# Altium project TivaC.PrjPcb
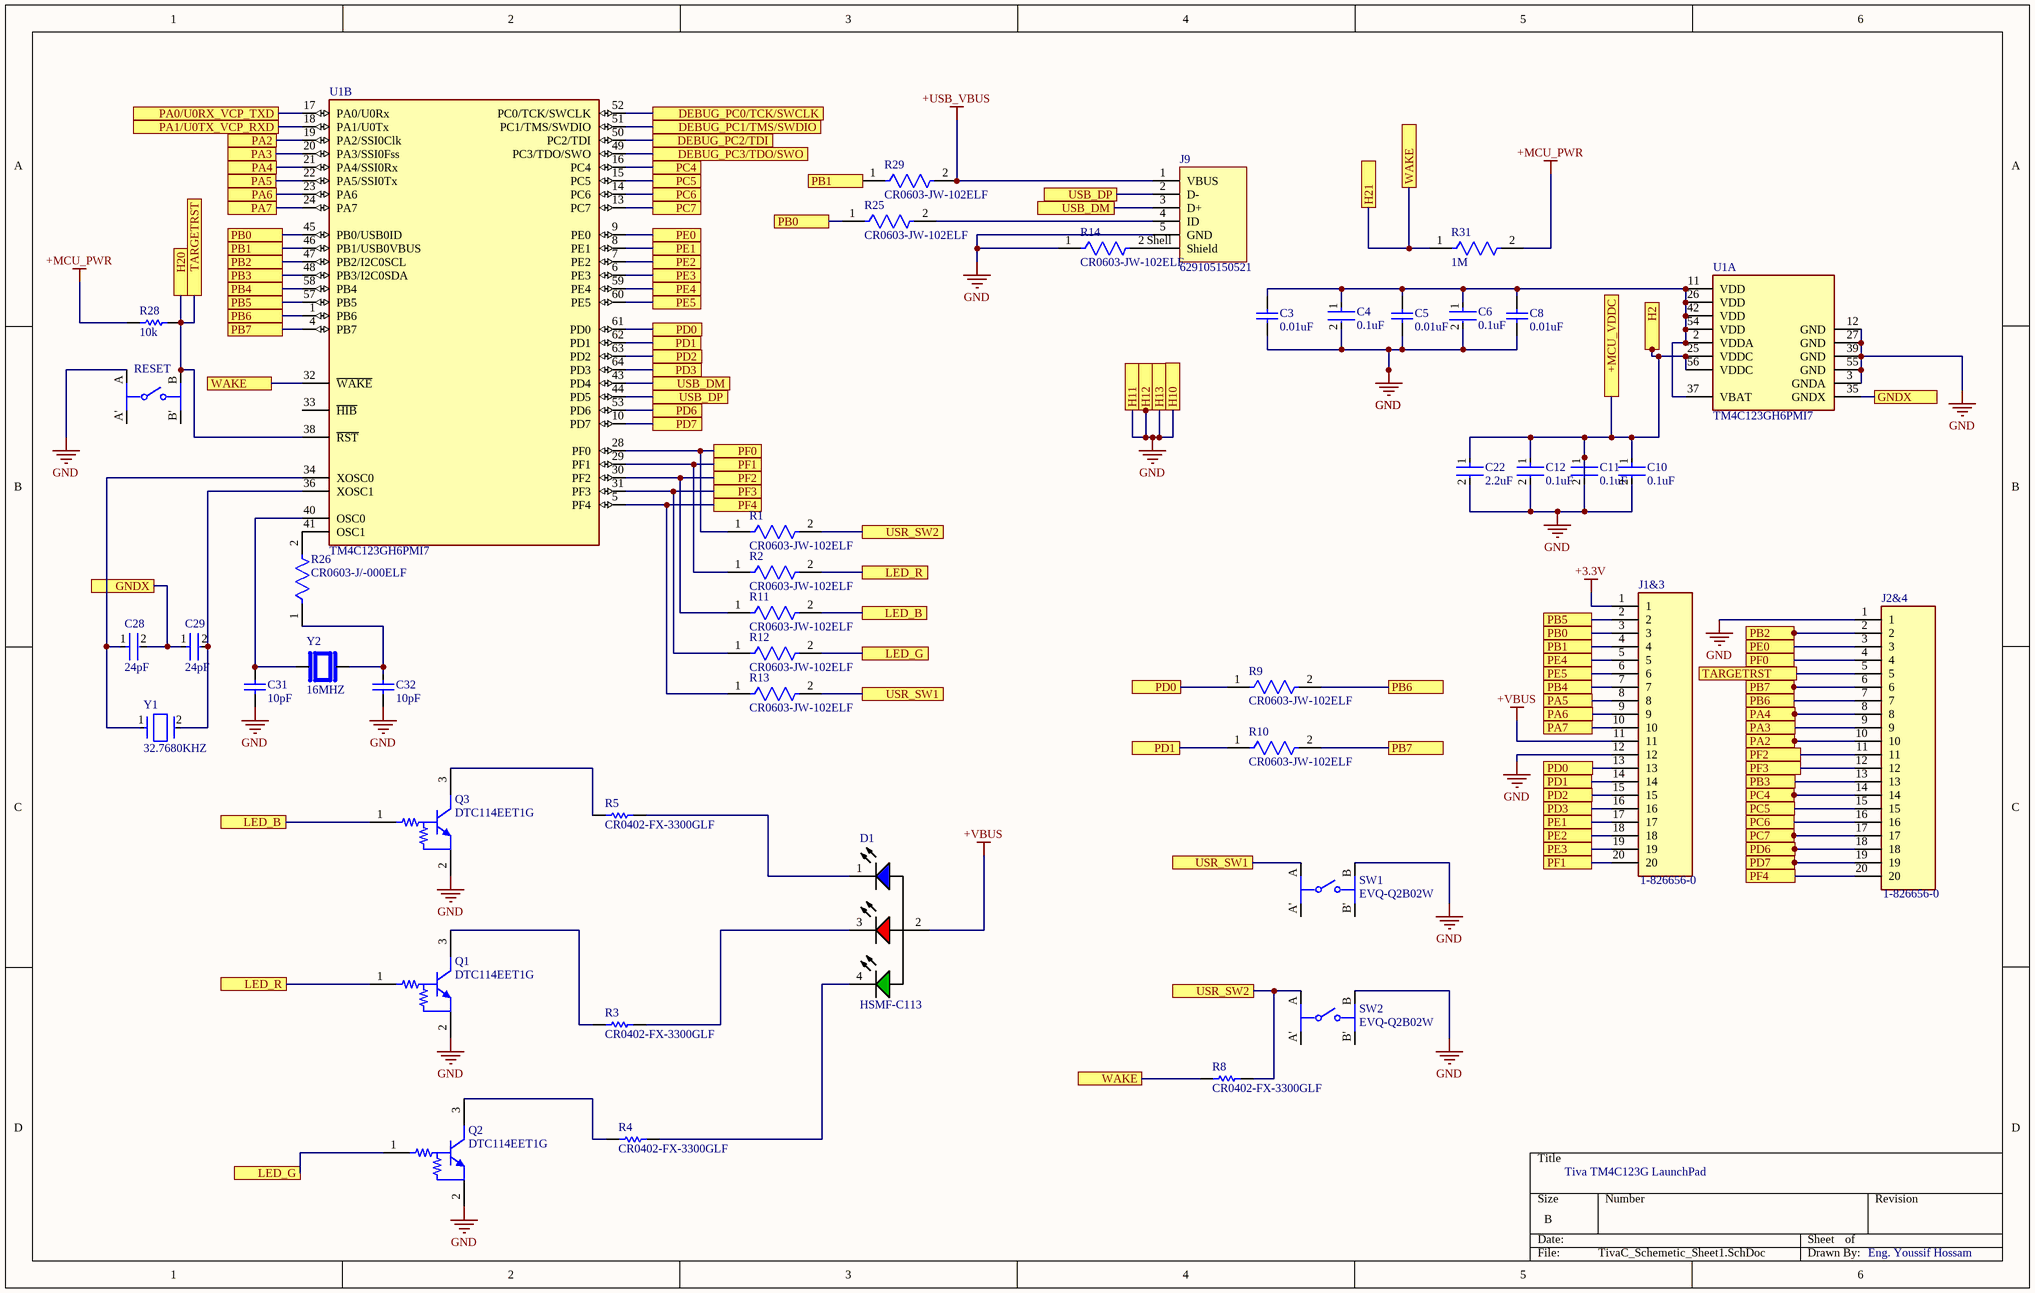
[diagram p0: TivaC_Schemetic_Sheet1.SchDoc]
Date: 8/5/2024; Designer: Eng. Youssif Hossam; Title: Tiva TM4C123G LaunchPad
2 sheets, 73 parts. Net scope: flat (ports and power ports of the same name join across sheets).
Board file: PCB1.PcbDoc
Sheets:
  TivaC_Schemetic_Sheet1.SchDoc
  TivaC_Schemetic_Sheet2.SchDoc

## Sheet TivaC_Schemetic_Sheet1.SchDoc: Tiva TM4C123G LaunchPad
size B; SheetNumber: 1; SheetTotal: 2

### Parts
C3  0.01uF  [CAPC1005X55X30LL05T10]
C4  0.1uF  [FP-C0402-BB-MFG]
C5  0.01uF  [CAPC1005X55X30LL05T10]
C6  0.1uF  [FP-C0402-BB-MFG]
C8  0.01uF  [CAPC1005X55X30LL05T10]
C10  0.1uF  [FP-C0402-BB-MFG]
C11  0.1uF  [FP-C0402-BB-MFG]
C12  0.1uF  [FP-C0402-BB-MFG]
C22  2.2uF  [FP-C0603C225K4PACTU-MFG]
C28  24pF  [FP-C0402-BB-MFG]
C29  24pF  [FP-C0402-BB-MFG]
C31  10pF  [CAPC1005X55X25ML05T05]
C32  10pF  [CAPC1005X55X25ML05T05]
D1  HSMF-C113  [AVAG-HSMF-C11X_H1_V]
J1&3  1-826656-0  [TE_1-826656-0]
J2&4  1-826656-0  [TE_1-826656-0]
J9  629105150521  [629105150521]
Q1  DTC114EET1G  [ONSC-SC-75-3-463-01_V]
Q2  DTC114EET1G  [ONSC-SC-75-3-463-01_V]
Q3  DTC114EET1G  [ONSC-SC-75-3-463-01_V]
R1  CR0603-JW-102ELF  [FP-CR0603-IPC_A]
R2  CR0603-JW-102ELF  [FP-CR0603-IPC_A]
R3  CR0402-FX-3300GLF  [RESC1005X40X25NL10T10]
R4  CR0402-FX-3300GLF  [RESC1005X40X25NL10T10]
R5  CR0402-FX-3300GLF  [RESC1005X40X25NL10T10]
R8  CR0402-FX-3300GLF  [RESC1005X40X25NL10T10]
R9  CR0603-JW-102ELF  [FP-CR0603-IPC_A]
R10  CR0603-JW-102ELF  [FP-CR0603-IPC_A]
R11  CR0603-JW-102ELF  [FP-CR0603-IPC_A]
R12  CR0603-JW-102ELF  [FP-CR0603-IPC_A]
R13  CR0603-JW-102ELF  [FP-CR0603-IPC_A]
R14  CR0603-JW-102ELF  [FP-CR0603-IPC_A]
R25  CR0603-JW-102ELF  [FP-CR0603-IPC_A]
R26  CR0603-J/-000ELF  [FP-CR0603-MFG]
R28  10k  [RESC1005X40X25NL10T10]
R29  CR0603-JW-102ELF  [FP-CR0603-IPC_A]
R31  1M  [FP-CR0402-MFG]
RESET  EVQ-Q2B02W  [FP-EVQ-Q2B02W-MFG]  (value not drawn)
SW1  EVQ-Q2B02W  [FP-EVQ-Q2B02W-MFG]
SW2  EVQ-Q2B02W  [FP-EVQ-Q2B02W-MFG]
U1  TM4C123GH6PMI7  [FP-PM0064A-MFG]  (parts A,B of 2)
Y1  32.7680KHZ  [FP-AB26TRB-MFG]
Y2  16MHZ  [XTAL_NX5032GA-16.000000MHZ-LN-CD-1]

### Ports
+MCU_VDDC, DEBUG_PC0/TCK/SWCLK (see TivaC_Schemetic_Sheet2[4A], TivaC_Schemetic_Sheet2[4C]), DEBUG_PC1/TMS/SWDIO (see TivaC_Schemetic_Sheet2[4A], TivaC_Schemetic_Sheet2[4C]), DEBUG_PC2/TDI (see TivaC_Schemetic_Sheet2[4A]), DEBUG_PC3/TDO/SWO (see TivaC_Schemetic_Sheet2[4A], TivaC_Schemetic_Sheet2[4B]), GNDX (see TivaC_Schemetic_Sheet1[1B]), GNDX (see TivaC_Schemetic_Sheet1[6B]), H2, H10, H11, H12, H13 (see TivaC_Schemetic_Sheet2[4B]), H20, H21, LED_B (see TivaC_Schemetic_Sheet1[1C]), LED_B (see TivaC_Schemetic_Sheet1[3B]), LED_G (see TivaC_Schemetic_Sheet1[1D]), LED_G (see TivaC_Schemetic_Sheet1[3C]), LED_R (see TivaC_Schemetic_Sheet1[1D]), LED_R (see TivaC_Schemetic_Sheet1[3B]), PA0/U0RX_VCP_TXD (see TivaC_Schemetic_Sheet2[4A]), PA1/U0TX_VCP_RXD (see TivaC_Schemetic_Sheet2[4A]), PA2 (see TivaC_Schemetic_Sheet1[1A]), PA2 (see TivaC_Schemetic_Sheet1[6C]), PA3 (see TivaC_Schemetic_Sheet1[1A]), PA3 (see TivaC_Schemetic_Sheet1[6C]), PA4 (see TivaC_Schemetic_Sheet1[1A]), PA4 (see TivaC_Schemetic_Sheet1[6C]), PA5 (see TivaC_Schemetic_Sheet1[1A]), PA5 (see TivaC_Schemetic_Sheet1[5C]), PA6 (see TivaC_Schemetic_Sheet1[1A]), PA6 (see TivaC_Schemetic_Sheet1[5C]), PA7 (see TivaC_Schemetic_Sheet1[1A]), PA7 (see TivaC_Schemetic_Sheet1[5C]), PB0 (see TivaC_Schemetic_Sheet1[1A], TivaC_Schemetic_Sheet1[3A]), PB0 (see TivaC_Schemetic_Sheet1[1A], TivaC_Schemetic_Sheet1[5B]), PB0 (see TivaC_Schemetic_Sheet1[3A], TivaC_Schemetic_Sheet1[5B]), PB1 (see TivaC_Schemetic_Sheet1[1A], TivaC_Schemetic_Sheet1[3A]), PB1 (see TivaC_Schemetic_Sheet1[1A], TivaC_Schemetic_Sheet1[5C]), PB1 (see TivaC_Schemetic_Sheet1[3A], TivaC_Schemetic_Sheet1[5C]), PB2 (see TivaC_Schemetic_Sheet1[1A]), PB2 (see TivaC_Schemetic_Sheet1[6B]), PB3 (see TivaC_Schemetic_Sheet1[1A]), PB3 (see TivaC_Schemetic_Sheet1[6C]), PB4 (see TivaC_Schemetic_Sheet1[1A]), PB4 (see TivaC_Schemetic_Sheet1[5C]), PB5 (see TivaC_Schemetic_Sheet1[1A]), PB5 (see TivaC_Schemetic_Sheet1[5B]), PB6 (see TivaC_Schemetic_Sheet1[1A], TivaC_Schemetic_Sheet1[5C]), PB6 (see TivaC_Schemetic_Sheet1[1A], TivaC_Schemetic_Sheet1[6C]), PB6 (see TivaC_Schemetic_Sheet1[5C], TivaC_Schemetic_Sheet1[6C]), PB7 (see TivaC_Schemetic_Sheet1[1B], TivaC_Schemetic_Sheet1[5C]), PB7 (see TivaC_Schemetic_Sheet1[1B], TivaC_Schemetic_Sheet1[6C]), PB7 (see TivaC_Schemetic_Sheet1[5C], TivaC_Schemetic_Sheet1[6C]), PC4 (see TivaC_Schemetic_Sheet1[2A]), PC4 (see TivaC_Schemetic_Sheet1[6C]), PC5 (see TivaC_Schemetic_Sheet1[2A]), PC5 (see TivaC_Schemetic_Sheet1[6C]), PC6 (see TivaC_Schemetic_Sheet1[2A]), PC6 (see TivaC_Schemetic_Sheet1[6C]), PC7 (see TivaC_Schemetic_Sheet1[2A]), PC7 (see TivaC_Schemetic_Sheet1[6C]), PD0 (see TivaC_Schemetic_Sheet1[2B], TivaC_Schemetic_Sheet1[4C]), PD0 (see TivaC_Schemetic_Sheet1[2B], TivaC_Schemetic_Sheet1[5C]), PD0 (see TivaC_Schemetic_Sheet1[4C], TivaC_Schemetic_Sheet1[5C]), PD1 (see TivaC_Schemetic_Sheet1[2B], TivaC_Schemetic_Sheet1[4C]), PD1 (see TivaC_Schemetic_Sheet1[2B], TivaC_Schemetic_Sheet1[5C]), PD1 (see TivaC_Schemetic_Sheet1[4C], TivaC_Schemetic_Sheet1[5C]), PD2 (see TivaC_Schemetic_Sheet1[2B]), PD2 (see TivaC_Schemetic_Sheet1[5C]), PD3 (see TivaC_Schemetic_Sheet1[2B]), PD3 (see TivaC_Schemetic_Sheet1[5C]), PD6 (see TivaC_Schemetic_Sheet1[2B]), PD6 (see TivaC_Schemetic_Sheet1[6C]), PD7 (see TivaC_Schemetic_Sheet1[2B]), PD7 (see TivaC_Schemetic_Sheet1[6C]), PE0 (see TivaC_Schemetic_Sheet1[2A]), PE0 (see TivaC_Schemetic_Sheet1[6C]), PE1 (see TivaC_Schemetic_Sheet1[2A]), PE1 (see TivaC_Schemetic_Sheet1[5C]), PE2 (see TivaC_Schemetic_Sheet1[2A]), PE2 (see TivaC_Schemetic_Sheet1[5C]), PE3 (see TivaC_Schemetic_Sheet1[2A]), PE3 (see TivaC_Schemetic_Sheet1[5C]), PE4 (see TivaC_Schemetic_Sheet1[2A]), PE4 (see TivaC_Schemetic_Sheet1[5C]), PE5 (see TivaC_Schemetic_Sheet1[2A]), PE5 (see TivaC_Schemetic_Sheet1[5C]), PF0 (see TivaC_Schemetic_Sheet1[3B]), PF0 (see TivaC_Schemetic_Sheet1[6C]), PF1 (see TivaC_Schemetic_Sheet1[3B]), PF1 (see TivaC_Schemetic_Sheet1[5C]), PF2 (see TivaC_Schemetic_Sheet1[3B]), PF2 (see TivaC_Schemetic_Sheet1[6C]), PF3 (see TivaC_Schemetic_Sheet1[3B]), PF3 (see TivaC_Schemetic_Sheet1[6C]), PF4 (see TivaC_Schemetic_Sheet1[3B]), PF4 (see TivaC_Schemetic_Sheet1[6C]), TARGETRST (see TivaC_Schemetic_Sheet1[1A], TivaC_Schemetic_Sheet2[4A]), TARGETRST (see TivaC_Schemetic_Sheet1[6C], TivaC_Schemetic_Sheet2[4A]), USB_DM (see TivaC_Schemetic_Sheet1[2B]), USB_DM (see TivaC_Schemetic_Sheet1[4A]), USB_DP (see TivaC_Schemetic_Sheet1[2B]), USB_DP (see TivaC_Schemetic_Sheet1[4A]), USR_SW1 (see TivaC_Schemetic_Sheet1[3C]), USR_SW1 (see TivaC_Schemetic_Sheet1[4C]), USR_SW2 (see TivaC_Schemetic_Sheet1[3B]), USR_SW2 (see TivaC_Schemetic_Sheet1[4D]), WAKE (see TivaC_Schemetic_Sheet1[1B], TivaC_Schemetic_Sheet1[4D]), WAKE (see TivaC_Schemetic_Sheet1[1B], TivaC_Schemetic_Sheet1[5A]), WAKE (see TivaC_Schemetic_Sheet1[4D], TivaC_Schemetic_Sheet1[5A])

### Nets
+3.3V: J1&3.1
+MCU_PWR: R28.1 R31.2
+USB_VBUS: J9.1(VBUS) R29.2
+VBUS: D1.2(A) J1&3.11
GND: C3.1 C4.2 C5.1 C6.2 C8.1 C10.2 C11.2 C12.2 C22.2 C31.1 C32.1 J1&3.12 J2&4.1 J9.5(GND) Q1.2(E) Q2.2(E) Q3.2(E) R14.1 RESET.A SW1.B SW2.B U1.3(GNDA) U1.12(GND) U1.27(GND) U1.39(GND) U1.55(GND) ; port H11, port H12, port H13, port H10
NetC3_2: C3.2 C4.1 C5.2 C6.1 C8.2 U1.2(VDDA) U1.11(VDD) U1.26(VDD) U1.37(VBAT) U1.42(VDD) U1.54(VDD)
NetC10_1: C10.1 C11.1 C12.1 C22.1 U1.25(VDDC) U1.56(VDDC) ; port H2, port +MCU_VDDC
NetC28_1: C28.1 U1.34(XOSC0) Y1.1
NetC28_2: C28.2 C29.1 U1.35(GNDX) ; port GNDX
NetC29_2: C29.2 U1.36(XOSC1) Y1.2
NetC31_2: C31.2 U1.40(OSC0) Y2.1
NetC32_2: C32.2 R26.1 Y2.2
NetD1_1: D1.1(K) R5.2
NetD1_3: D1.3(K) R3.2
NetD1_4: D1.4(K) R4.2
NetJ1&3_2: J1&3.2 U1.57(PB5) ; port PB5
NetJ1&3_3: J1&3.3 R25.1 U1.45(PB0/USB0ID) ; port PB0
NetJ1&3_4: J1&3.4 R29.1 U1.46(PB1/USB0VBUS) ; port PB1
NetJ1&3_5: J1&3.5 U1.59(PE4) ; port PE4
NetJ1&3_6: J1&3.6 U1.60(PE5) ; port PE5
NetJ1&3_7: J1&3.7 U1.58(PB4) ; port PB4
NetJ1&3_8: J1&3.8 U1.22(PA5/SSI0Tx) ; port PA5
NetJ1&3_9: J1&3.9 U1.23(PA6) ; port PA6
NetJ1&3_10: J1&3.10 U1.24(PA7) ; port PA7
NetJ1&3_13: J1&3.13 R9.1 U1.61(PD0) ; port PD0
NetJ1&3_14: J1&3.14 R10.1 U1.62(PD1) ; port PD1
NetJ1&3_15: J1&3.15 U1.63(PD2) ; port PD2
NetJ1&3_16: J1&3.16 U1.64(PD3) ; port PD3
NetJ1&3_17: J1&3.17 U1.8(PE1) ; port PE1
NetJ1&3_18: J1&3.18 U1.7(PE2) ; port PE2
NetJ1&3_19: J1&3.19 U1.6(PE3) ; port PE3
NetJ1&3_20: J1&3.20 R2.1 U1.29(PF1) ; port PF1
NetJ2&4_2: J2&4.2 U1.47(PB2/I2C0SCL) ; port PB2
NetJ2&4_3: J2&4.3 U1.9(PE0) ; port PE0
NetJ2&4_4: J2&4.4 R1.1 U1.28(PF0) ; port PF0
NetJ2&4_5: J2&4.5 R28.2 RESET.B U1.38(~{RST}) ; port TARGETRST, port H20
NetJ2&4_6: J2&4.6 R10.2 U1.4(PB7) ; port PB7
NetJ2&4_7: J2&4.7 R9.2 U1.1(PB6) ; port PB6
NetJ2&4_8: J2&4.8 U1.21(PA4/SSI0Rx) ; port PA4
NetJ2&4_9: J2&4.9 U1.20(PA3/SSI0Fss) ; port PA3
NetJ2&4_10: J2&4.10 U1.19(PA2/SSI0Clk) ; port PA2
NetJ2&4_11: J2&4.11 R11.1 U1.30(PF2) ; port PF2
NetJ2&4_12: J2&4.12 R12.1 U1.31(PF3) ; port PF3
NetJ2&4_13: J2&4.13 U1.48(PB3/I2C0SDA) ; port PB3
NetJ2&4_14: J2&4.14 U1.16(PC4) ; port PC4
NetJ2&4_15: J2&4.15 U1.15(PC5) ; port PC5
NetJ2&4_16: J2&4.16 U1.14(PC6) ; port PC6
NetJ2&4_17: J2&4.17 U1.13(PC7) ; port PC7
NetJ2&4_18: J2&4.18 U1.53(PD6) ; port PD6
NetJ2&4_19: J2&4.19 U1.10(PD7) ; port PD7
NetJ2&4_20: J2&4.20 R13.1 U1.5(PF4) ; port PF4
NetJ9_2: J9.2(D-) U1.44(PD5) ; port USB_DP
NetJ9_3: J9.3(D+) U1.43(PD4) ; port USB_DM
NetJ9_4: J9.4(ID) R25.2
NetJ9_Shell: J9.Shell(Shield) R14.2
NetQ1_1: Q1.1(B) R2.2 ; port LED_R
NetQ1_3: Q1.3(C) R3.1
NetQ2_1: Q2.1(B) R12.2 ; port LED_G
NetQ2_3: Q2.3(C) R4.1
NetQ3_1: Q3.1(B) R11.2 ; port LED_B
NetQ3_3: Q3.3(C) R5.1
NetR1_2: R1.2 R8.2 SW2.A ; port USR_SW2
NetR8_1: R8.1 R31.1 U1.32(~{WAKE}) ; port WAKE, port H21
NetR13_2: R13.2 SW1.A ; port USR_SW1
NetR18_2: U1.51(PC1/TMS/SWDIO) ; port DEBUG_PC1/TMS/SWDIO
NetR23_2: U1.52(PC0/TCK/SWCLK) ; port DEBUG_PC0/TCK/SWCLK
NetR26_2: R26.2 U1.41(OSC1)
NetU1_17: U1.17(PA0/U0Rx) ; port PA0/U0RX_VCP_TXD
NetU1_18: U1.18(PA1/U0Tx) ; port PA1/U0TX_VCP_RXD
NetU1_49: U1.49(PC3/TDO/SWO) ; port DEBUG_PC3/TDO/SWO
NetU1_50: U1.50(PC2/TDI) ; port DEBUG_PC2/TDI

Not connected (* = marked no-connect by the designer): RESET A' B'; SW1 A' B'; SW2 A' B'; U1 33(~{HIB})

### Notes on the sheet
- Labels drawn without touching a wire or pin: GND

### Library data of the parts
C3 C5 C8 = CMP-1034-01886-2: Part Number: C0402C103K5RACTU; Manufacturer: Kemet
C4 C6 C10-C12 = CMP-1034-02068-3: CAP CER 0.1UF 16V 5% X7R 0402; Manufacturer: Kemet; Manufacturer Part Number: C0402C104J4RACTU; Value: 0.10 μF; Temperature Coefficient: 15%; Tolerance: 0.05; Material: Ceramic; ComponentLink2URL: https://content.kemet.com/datasheets/KEM_C1002_X7R_SMD.pdf; Automotive: No; Device Class L2: Capacitors; Temperature: -55°C to +125°C; RoHS: TRUE; Voltage Rating: 16 V; ComponentLink2Description: Datasheet; Device Class L3: Ceramic Capacitors; Temperature Range Low: -55°C; Ipc Land Pattern Name: CAPC10050X50; Device Class L1: Passive Components; Temperature Range High: +125°C; Package: C0402-BB; Capacitance: 0.10 μF; Category: Cap; Mouser Description: CAP CER 0.1UF 16V X7R 0402; Height: 0.55mm; Digikey Description: CAP CER 0.1UF 16V 5% X7R 0402; Octopart: https://octopart.com/c0402c104j4ractu-kemet-12573893; Temperature Characteristic: X7R; Lead Free: Yes
C22 = CMP-2006-02259-2: CAP CER 2.2UF 16V X5R 0603; Dielectric Material: Ceramic; Tolerance: 10%; Dissipation Factor: 5%; Series: C; Voltage Rating (DC): 16V; REACH SVHC: No SVHC; RoHS Compliant: Yes; Number of Pins: 2; Max Operating Temperature: 85°C; Voltage Rating: 16V; Min Operating Temperature: -55°C; Termination: SMD/SMT; Dielectric: X5R; Packaging: Tape and Reel; Contact Plating: Tin; Case Code (Metric): 1608; Height: 0.8mm; Capacitance: 2.2uF; Case/Package: 0603; Width: 0.8mm; Construction: Flat; Depth: 0.8mm; Thickness: 0.034inch; Radiation Hardening: No; Length: 1.6mm; Mount: Surface Mount; Case Code (Imperial): 0603; Voltage: 16V; Package Quantity: 1; Lead Free: Lead Free
C28 C29 = CMP-1034-00941-3: Manufacturer Part Number: C0402C240J5GACTU; Manufacturer: Kemet; Temperature Coefficient: 15%; Voltage Rating: 50 V; Tolerance: 0.05; Material: Ceramic; Temperature Characteristic: C0G; Value: 24 pF; Lead Free: Yes; Automotive: No; Category: Cap; Device Class L1: Passive Components; Ipc Land Pattern Name: CAPC10050X50; Package: C0402-BB; Mouser Description: Multilayer Ceramic Capacitors MLCC - SMD/SMT 50volts 24pF C0G 5%; Temperature: -55°C to +125°C; Temperature Range Low: -55°C; RoHS: TRUE; Height: 0.55mm; ComponentLink2URL: https://content.kemet.com/datasheets/KEM_C1002_X7R_SMD.pdf; Device Class L2: Capacitors; Digikey Description: CAP CER 24PF 50V 5% NP0 0402; Capacitance: 24 pF; ComponentLink2Description: Datasheet; Octopart: https://octopart.com/c0402c240j5gactu-kemet-9138560; Device Class L3: Ceramic Capacitors; Temperature Range High: +125°C
C31 C32 = CMP-2100-03589-1: Chip Capacitor, 10 pF, +/- 5%, 50 V, -55 to 125 degC, 0402 (1005 Metric), RoHS, Tape and Reel; Manufacturer: Yageo; Insulation Resistance: 100GR; Voltage Rating (DC): 50V; Dielectric Material: Ceramic; Temperature Coefficient: 30ppm/degC; Dielectric: C0G; Termination: SMD/SMT; Package Reference: 0402; Lead Free: LeadFree; Composition: Ceramic; Tolerance: 5%; Case Code (Metric): 1005; Voltage Rating: 50V; Packaging: TapeandReel; Manufacturer URL: http://www.yageo.com/; REACH SVHC: NoSVHC; Max Operating Temperature: 125degC; Length: 1mm; Mount: SurfaceMount; Depth: 0.5mm; Min Operating Temperature: -55degC; Number of Pins: 2; Width: 0.02inch; Datasheet Version: Rev. 14, 07/2016; Package Quantity: 1; Datasheet URL: http://www.yageo.com/documents/recent/UPY-GP_NP0_16V-to-50V_14.pdf; Case Code (Imperial): 0402; RoHSCompliant: True; Radiation Hardening: No; Height: 0.5mm; Case/Package: 0402; Thickness: 0.022inch; Capacitance: 10pF; Package Description: 2-Pin Surface Mount Device, Body 1 x 0.5 mm; Voltage: 50V
D1 = CMP-2000-06422-1: Right Angle Tricolor Surface Mount Chip LED, Red/Green/Blue, -40 to 85 degC, 4-Pin SMD, RoHS, Tape and Reel; Manufacturer: Avago; Product Length (mm): 2.5mm; Product Depth (mm): 1mm; Shape Type: Rectangular; Dominant Wave Length: 470/572/626nm; Number of  Elements: 3; Type: Tri-Color; Lens Type: ColorlessDiffused; Peak Wavelength: 468/570/637nm; Luminous Intensity: 60/50/80mcd; Test Current (It): 20mA; Power Dissipation: 59/39/36W; Viewing Angle: 125/125/120deg; Rad Hardened: No; Reverse Voltage: 5V; DELETED: Compliant; Forward Voltage: 3.9/2.6/2V; High Brightness: Yes; Manufacturer URL: http://www.avagotech.com/; Datasheet URL: https://datasheet.ciiva.com/15117/getdatasheetpartid-133115-15117679.pdf; Main Category: ChipLED; Package Reference: HSMF-C11X; Mounting Technology: SurfaceMount; Datasheet Version: 04/2010; Lum Intensity: 60/50/80mcd; Lens Dimensions: 2.1x1x0.5mm; Forward Current: 20mA; Pin Count: 4; Package Description: 4-Pin Surface Mount Device, Body 2.5 x 1 mm; Packaging: TapeandReel; Package Type: ChipLed; Mounting: SurfaceMount; Operating Temp Range: -40Cto85C; Operating Temperature Classification: Industrial; Product Height (mm): 1mm
J1&3 J2&4 = 1-826656-0: Conn Unshrouded Header HDR 20 POS 2.54mm Solder ST Thru-Hole Box; MF: TE Connectivity; Purchase-URL: https://pricing.snapeda.com/search/part/1-826656-0/?ref=eda; Value: *; SnapEDA_Link: https://www.snapeda.com/parts/1-826656-0/TE%20Connectivity%20AMP%20Connectors/view-part/2881856/?ref=snap; Package: None; Availability: Good; Price: None; Check_prices: https://www.snapeda.com/parts/1-826656-0/TE%20Connectivity%20AMP%20Connectors/view-part/2881856/?ref=eda; MP: 1-826656-0
J9 = CMP-1502-03252-3: NexarPartId: 52645113; Number of Contacts: 5; Contact Resistance: 30mΩ; Connector Type: USB; Voltage Rating: 30V; Current Rating: 3A; USB Standard: USB 2.0; Gender: Receptacle; Insulation Resistance: 1GΩ; Height: 2.86mm; REACH SVHC: Unknown; RoHS: Compliant; Features: Shielded; Termination: SMD/SMT; Number of Pins: 5; Contact Plating: Gold; Packaging: Tape and Reel; Contact Material: Gold; Mount: Horizontal, Surface Mount; Max Operating Temperature: 85°C; Lead Free: Lead Free; Min Operating Temperature: -40°C; Orientation: Horizontal; Operating Supply Voltage: 30V
Q1-Q3 = CMP-0630-00210-1: Digital Transistor (BRT), R1=10 kOhm, R2=10 kOhm, NPN Transistor, 3-Pin SC-75, Pb-Free, Tape and Reel; Manufacturer: On Semiconductor; IC Continuous (A): 0.1; hFE Min: 35; V(BR)CEO Min (V): 50; R1/R2 Typ: 1; Mounting Technology: Surface Mount; RoHS: TRUE; Packing: Tape and Reel; DatasheetVersion: Rev. 5; ComponentLink1Description: Manufacturer URL; ComponentLink3Description: Package Specification; PartNumber: DTC114EET1G; PackageReference: SC-75-3-463-01; PackageVersion: Rev. F, 07/2005; ComponentLink1URL: http://www.onsemi.com/; Polarity: NPN; ComponentLink3URL: http://www.onsemi.com/pub_link/Collateral/463-01.PDF; ComponentLink2Description: Datasheet; PackageDescription: 3-Pin Small Outline Transistor, Body 1.6 x 0.8 mm, Pitch 0.5 mm; ComponentLink2URL: http://www.onsemi.cn/pub_link/Collateral/DTC114E-D.PDF
R1 R2 R9-R14 R25 R29 = CMP-07231-000375-1: Thick Film Chip Resistors 0603 1kΩ 0.1W 5% 200ppm/°C; Max Power Dissipation: 100mW; Resistance: 1kR; Voltage Rating: 50V; Mount: Surface Mount; Contact Plating: Tin; Case/Package: 0603; Termination: SMD/SMT; Width: 0.8mm; Height: 0.022inch; Max Operating Temperature: 155°C; Package Quantity: 5000; Radiation Hardening: No; Thickness: 457um; Composition: Thick Film; Length: 1.6mm; Power Rating: 100mW; Military Standard: Not; Packaging: Tape and Reel; Temperature Coefficient: 200ppm/°C; REACH SVHC: No SVHC; Case Code (Imperial): 0603; Tolerance: 5%; Case Code (Metric): 1608; Number of Pins: 2; Depth: 0.8mm; Voltage Rating (DC): 50V; Min Operating Temperature: -55°C; Features: Moisture Resistant; Number of Terminations: 2
R3-R5 R8 = CMP-1011-00454-2: 330; Manufacturer: Bourns; Part Number: CR0402-FX-3300GLF
R26 = CMP-07231-000023-1: Thick Film Chip Resistors 0603 0Ω 0.1W 5%; Power Rating: 100mW; Resistance: 0mR; Voltage Rating (DC): 50V; Tolerance: 1%; Temperature Coefficient: 500ppm/°C; Depth: 0.8mm; Height: 0.45mm; Case Code (Metric): 1608; Number of Pins: 2; Max Operating Temperature: 155°C; Mount: Surface Mount; REACH SVHC: No SVHC; Radiation Hardening: No; Width: 0.8mm; Max Power Dissipation: 100mW; Thickness: 457um; Package Quantity: 5000; Composition: Thick Film; Case/Package: 0603; Military Standard: Not; Packaging: Tape and Reel; Voltage Rating: 50V; Case Code (Imperial): 0603; Min Operating Temperature: -55°C; Contact Plating: Tin; Length: 1.6mm; Termination: SMD/SMT
R28 = CMP-2002-04694-1: Manufacturer: Bourns; Part Number: CR0402-FX-1002GLF
R31 = CMP-2002-05525-2: Thick Film Chip Resistors 0402 1MΩ 0.0625W 5% 200ppm/°C; Voltage Rating: 50V; Max Power Dissipation: 63mW; Resistance: 1MR; Power Rating: 62.5mW; Case/Package: 0402; Depth: 0.5mm; Case Code (Imperial): 0402; Width: 0.02inch; Length: 1mm; Tolerance: 5%; Min Operating Temperature: -55°C; Number of Terminations: 2; Thickness: 356um; Case Code (Metric): 1005; Radiation Hardening: No; Height: 0.016inch; Military Standard: Not; Mount: Surface Mount; Termination: SMD/SMT; Composition: Thick Film; Temperature Coefficient: 200ppm/°C; Contact Plating: Tin; Packaging: Tape and Reel; Package Quantity: 10000; Max Operating Temperature: 125°C
RESET SW1 SW2 = CMP-05618-000078-1: SWITCH TACTILE SPST-NO 0.02A 15V; Contact Resistance: 100mR; Illumination Type: Non-Illuminated; Electrical Life: 2000000Cycles; Voltage Rating (AC): 250V; Throw Configuration: SPST; Contact Current Rating: 20mA; Actuator Type: Standard; Switch Function: Off-Mom; Switch Travel: 0.2mm; Operating Force: 0.5N; Actuator Length: 0.7mm; Actuator Color: White; Package Quantity: 1; Min Operating Temperature: -40°C; Voltage Rating (DC): 15V; Mechanical Life: 2000000Cycles; Radiation Hardening: No; Thickness: 1.8mm; Mount: Surface Mount; Current Rating: 20mA; Case/Package: SMD/SMT; Max Operating Temperature: 85°C; Series: EVQQ2; Lead Free: Lead Free; Termination: SMD/SMT; Packaging: Tape and Reel; Orientation: Straight; RoHS Compliant: Yes; Size: 1.8mm; Contact Plating: Silver; Color: White; Max Voltage Rating (DC): 15V
U1 = CMP-04869-000012-1: IC MCU 32BIT 256KB FLASH 64LQFP; Manufacturer: Texas Instruments; Max Supply Voltage: 3.63V; Standoff Height: 0.05mm; Number Of Timers/Counters: 12; Number Of Cores: 1; Number Of I/Os: 43; Number Of Spi Channels: 4; Memory Size: 256KBytes; Max Junction Temp: +96°C; Min Supply Voltage: 1.08V; Frequency: 80MHz; Data Bus Width: 32bits; Number Of Uart Channels: 8; Interface: I2C,SPI,UART,CAN,USB,IrDA,Other; Number Of Pwm Channels: 16; Ram Size: 32KBytes; Number Of A/D Converters: 2; Core Architecture: ARM Cortex-M4F; Memory Type: FLASH; Digikey Description: IC MCU 32BIT 256KB FLASH 64LQFP; Octopart: https://octopart.com/tm4c123gh6pmi7-texas+instruments-47641106; Category: IC; RoHS: TRUE; Ambient Temperature Range High: +85°C; Ipc Land Pattern Name: QFP50P1200X1200X160-64; Device Class L3: Microcontrollers; Ambient Temperature Range Low: -40°C; Manufacturer Part Number: TM4C123GH6PMI7; Automotive: No; ComponentLink2URL: http://www.ti.com/lit/gpn/tm4c123gh6pm; Number Of Adc Channels: 12; Device Class L2: Embedded Processors and Controllers; Temperature: -40°C to +96°C; Lead Free: Yes; ComponentLink2Description: Datasheet; Temperature Range High: +96°C; Package: PM0064A; Number Of Usb Channels: 1; Number Of I2C Channels: 4; Device Class L1: Integrated Circuits (ICs); Mouser Description: MCU 32-Bit Tiva C ARM Cortex M4F RISC 256KB Flash 1.2V/3.3V 64-Pin LQFP; Height: 1.6mm; Temperature Range Low: -40°C
Y1 = CMP-27762-006068-1: CRYSTAL 32.7680KHZ 12.5PF TH; Frequency Stability: -0.034ppm; Frequency Tolerance: 20ppm; Frequency: 32.768kHz; Operating Frequency: 32.768 kHz; Series Resistance: 50kR; Case/Package: Radial; Package Quantity: 500; Packaging: Tape and Reel; Lead Pitch: 2.54mm; Termination: Radial; Mount: Surface Mount; Min Operating Temperature: -40°C; REACH SVHC: No SVHC; Load Capacitance: 12.5pF; Lead Free: Lead Free; Max Operating Temperature: 85°C; Length: 6mm; Height: 0.075inch; Depth: 1.9mm; Tolerance: 20ppm; ESR (Equivalent Series Resistance): 50kR; Number of Pins: 2; Series: AB26TRB
Y2 = NX5032GA-16.000000MHZ-LN-CD-1: Package: None; Price: None; Availability: Unavailable; MP: NX5032GA-16.000000MHZ-LN-CD-1; Value: *

## Sheet TivaC_Schemetic_Sheet2.SchDoc: Tiva TM4C123G LaunchPad
size B; SheetNumber: 2; SheetTotal: 2
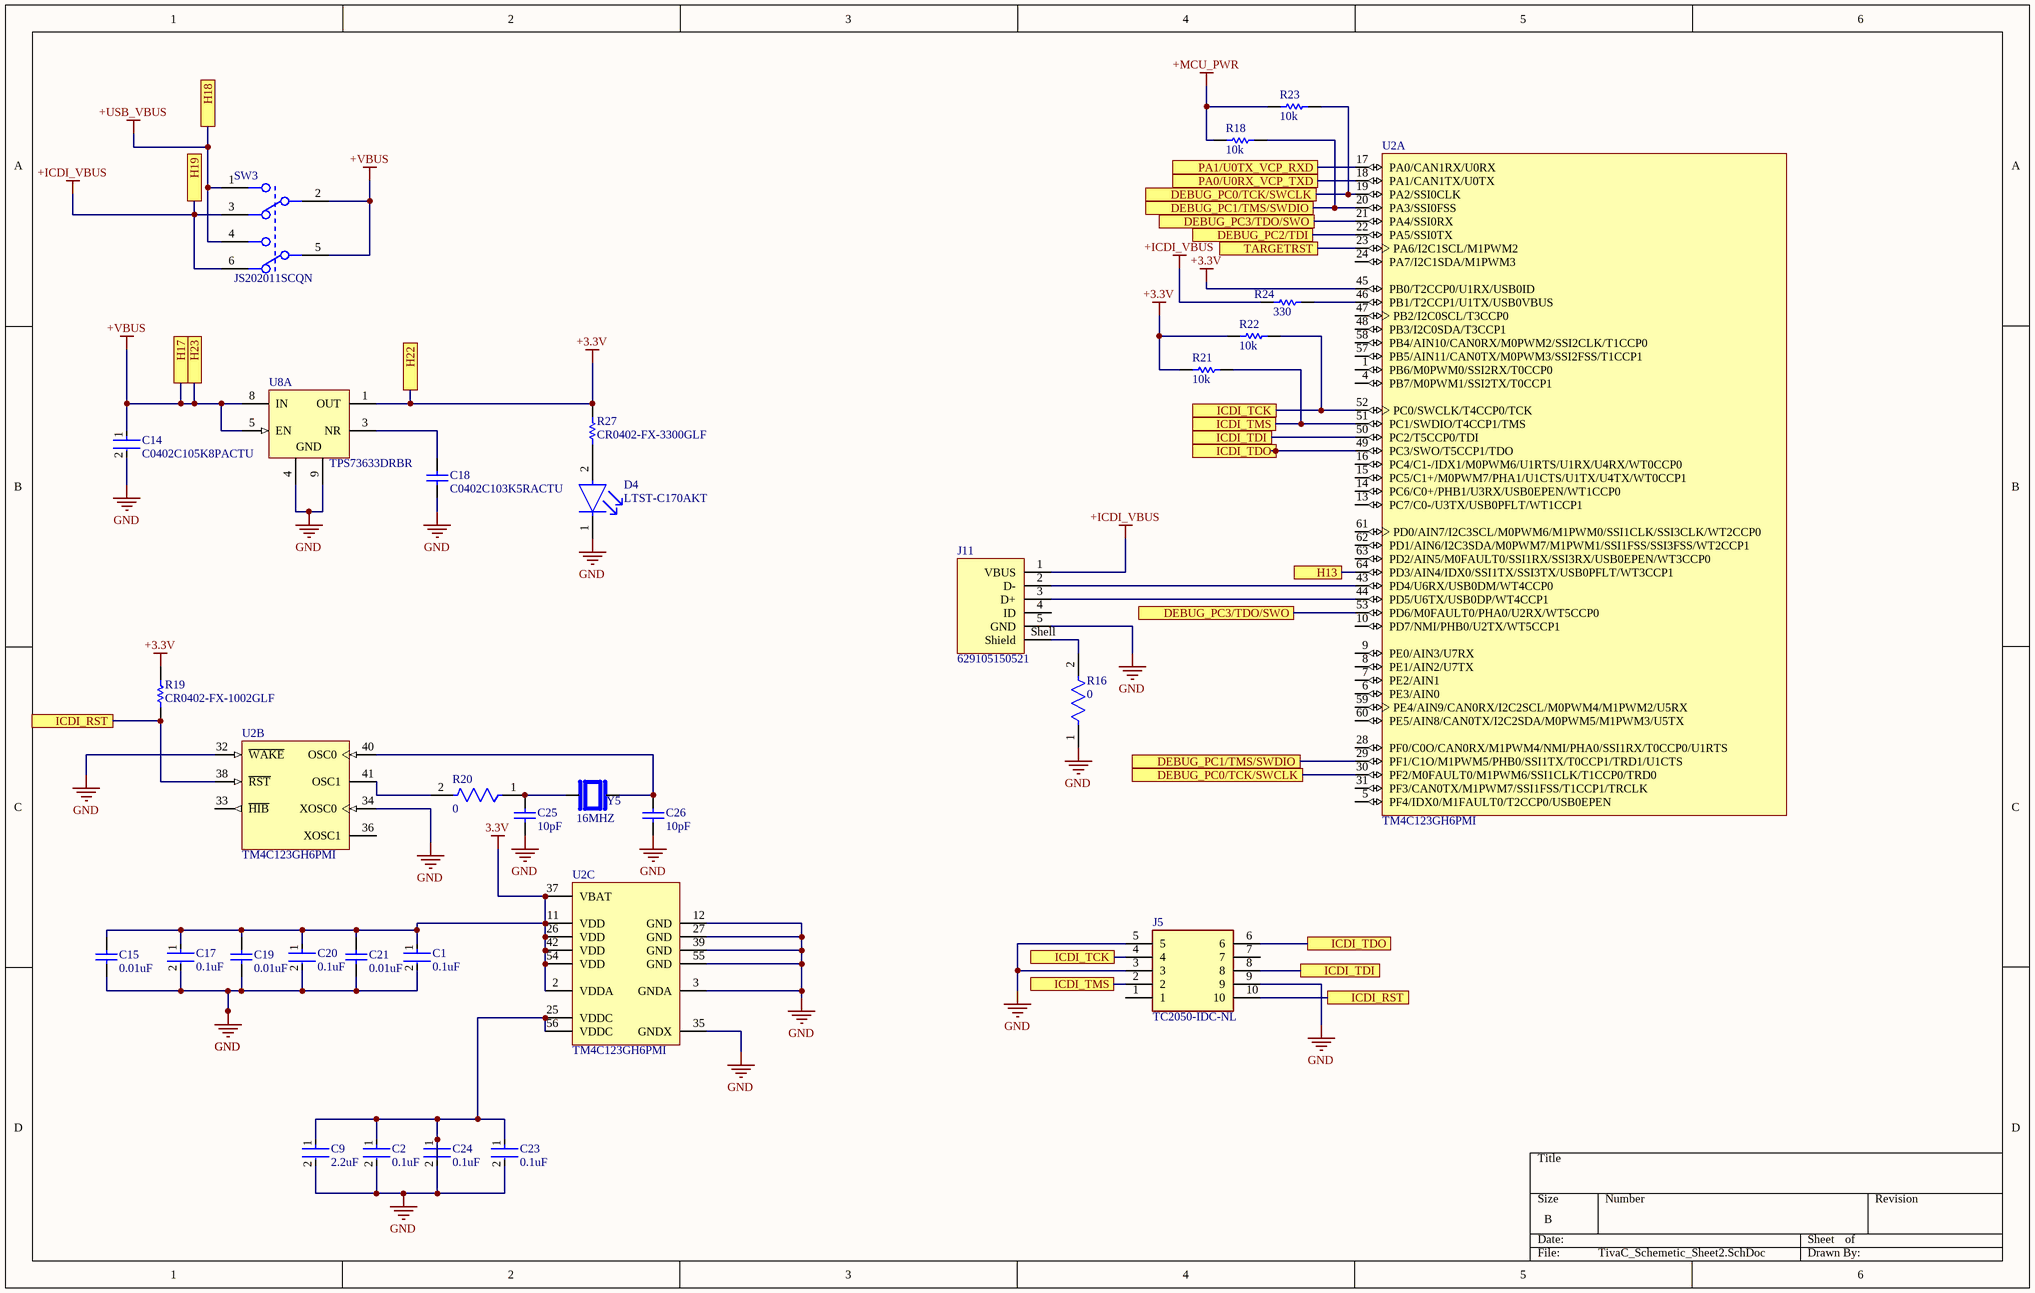
[diagram p1: TivaC_Schemetic_Sheet2.SchDoc]

### Parts
C1  0.1uF  [FP-C0402-BB-MFG]
C2  0.1uF  [FP-C0402-BB-MFG]
C9  2.2uF  [FP-C0603C225K4PACTU-MFG]
C14  C0402C105K8PACTU  [FP-C0402C105K8PACTU-MFG]
C15  0.01uF  [CAPC1005X55X30LL05T10]
C17  0.1uF  [FP-C0402-BB-MFG]
C18  C0402C103K5RACTU  [CAPC1005X55X30LL05T10]
C19  0.01uF  [CAPC1005X55X30LL05T10]
C20  0.1uF  [FP-C0402-BB-MFG]
C21  0.01uF  [CAPC1005X55X30LL05T10]
C23  0.1uF  [FP-C0402-BB-MFG]
C24  0.1uF  [FP-C0402-BB-MFG]
C25  10pF  [CAPC1005X55X25ML05T05]
C26  10pF  [CAPC1005X55X25ML05T05]
D4  LTST-C170AKT  [FP-LTST-C170AKT-MFG]
J5  TC2050-IDC-NL  [TAG-CONNECT_TC2050-IDC-NL]
J11  629105150521  [629105150521]
R16  0  [FP-CR0603-MFG]
R18  10k  [RESC1005X40X25NL10T10]
R19  CR0402-FX-1002GLF  [RESC1005X40X25NL10T10]
R20  0  [FP-CR0603-MFG]
R21  10k  [RESC1005X40X25NL10T10]
R22  10k  [RESC1005X40X25NL10T10]
R23  10k  [RESC1005X40X25NL10T10]
R24  330  [RESC1005X40X25NL10T10]
R27  CR0402-FX-3300GLF  [RESC1005X40X25NL10T10]
SW3  JS202011SCQN  [FP-JS202011SCQN-MFG]
U2  TM4C123GH6PMI  [PM0064A_L]  (parts A,B,C of 3)
U8  TPS73633DRBR  [DRB0008A_V]  (part A of 2)
Y5  16MHZ  [XTAL_NX5032GA-16.000000MHZ-LN-CD-1]

### Ports
DEBUG_PC0/TCK/SWCLK (see TivaC_Schemetic_Sheet1[2A], TivaC_Schemetic_Sheet2[4A]), DEBUG_PC0/TCK/SWCLK (see TivaC_Schemetic_Sheet1[2A], TivaC_Schemetic_Sheet2[4C]), DEBUG_PC1/TMS/SWDIO (see TivaC_Schemetic_Sheet1[2A], TivaC_Schemetic_Sheet2[4A]), DEBUG_PC1/TMS/SWDIO (see TivaC_Schemetic_Sheet1[2A], TivaC_Schemetic_Sheet2[4C]), DEBUG_PC2/TDI (see TivaC_Schemetic_Sheet1[2A]), DEBUG_PC3/TDO/SWO (see TivaC_Schemetic_Sheet1[2A], TivaC_Schemetic_Sheet2[4A]), DEBUG_PC3/TDO/SWO (see TivaC_Schemetic_Sheet1[2A], TivaC_Schemetic_Sheet2[4B]), H13 (see TivaC_Schemetic_Sheet1[4B]), H17, H18, H19, H22, H23, ICDI_RST (see TivaC_Schemetic_Sheet2[1C]), ICDI_RST (see TivaC_Schemetic_Sheet2[4D]), ICDI_TCK (see TivaC_Schemetic_Sheet2[4B]), ICDI_TCK (see TivaC_Schemetic_Sheet2[4C]), ICDI_TDI (see TivaC_Schemetic_Sheet2[4B]), ICDI_TDI (see TivaC_Schemetic_Sheet2[4D]), ICDI_TDO (see TivaC_Schemetic_Sheet2[4B]), ICDI_TDO (see TivaC_Schemetic_Sheet2[4C]), ICDI_TMS (see TivaC_Schemetic_Sheet2[4B]), ICDI_TMS (see TivaC_Schemetic_Sheet2[4D]), PA0/U0RX_VCP_TXD (see TivaC_Schemetic_Sheet1[1A]), PA1/U0TX_VCP_RXD (see TivaC_Schemetic_Sheet1[1A]), TARGETRST (see TivaC_Schemetic_Sheet1[1A], TivaC_Schemetic_Sheet1[6C])

### Nets
3.3V: C1.1 C15.2 C17.1 C19.2 C20.1 C21.2 U2.2(VDDA) U2.11(VDD) U2.26(VDD) U2.37(VBAT) U2.42(VDD) U2.54(VDD)
+3.3V: R19.2 R21.1 R22.1 R27.2 U2.45(PB0/T2CCP0/U1RX/USB0ID) U8.1(OUT) ; port H22
+ICDI_VBUS: J11.1(VBUS) R24.1 SW3.3 SW3.6 ; port H19
+MCU_PWR: R18.1 R23.1
+USB_VBUS: SW3.1 SW3.4 ; port H18
+VBUS: C14.1 SW3.2 SW3.5 U8.5(EN) U8.8(IN) ; port H23, port H17
GND: C1.2 C2.2 C9.2 C14.2 C15.1 C17.2 C18.1 C19.1 C20.2 C21.1 C23.2 C24.2 C25.1 C26.1 D4.1(C) J5.3 J5.5 J5.9 J11.5(GND) R16.1 U2.3(GNDA) U2.12(GND) U2.27(GND) U2.32(~{WAKE}) U2.34(XOSC0) U2.35(GNDX) U2.39(GND) U2.55(GND) U2.64(PD3/AIN4/IDX0/SSI1TX/SSI3TX/USB0PFLT/WT3CCP1) U8.4(GND) U8.9(GND) ; port H13
NetC2_1: C2.1 C9.1 C23.1 C24.1 U2.25(VDDC) U2.56(VDDC)
NetC18_2: C18.2 U8.3(NR)
NetC25_2: C25.2 R20.1 Y5.1
NetC26_2: C26.2 U2.40(OSC0) Y5.2
NetD4_2: D4.2(A) R27.1
NetJ2&4_5: U2.23(PA6/I2C1SCL/M1PWM2) ; port TARGETRST
NetJ5_2: J5.2 R21.2 U2.51(PC1/SWDIO/T4CCP1/TMS) ; port ICDI_TMS
NetJ5_4: J5.4 R22.2 U2.52(PC0/SWCLK/T4CCP0/TCK) ; port ICDI_TCK
NetJ5_6: J5.6 U2.49(PC3/SWO/T5CCP1/TDO) ; port ICDI_TDO
NetJ5_8: J5.8 U2.50(PC2/T5CCP0/TDI) ; port ICDI_TDI
NetJ5_10: J5.10 R19.1 U2.38(~{RST}) ; port ICDI_RST
NetJ11_2: J11.2(D-) U2.43(PD4/U6RX/USB0DM/WT4CCP0)
NetJ11_3: J11.3(D+) U2.44(PD5/U6TX/USB0DP/WT4CCP1)
NetJ11_Shell: J11.Shell(Shield) R16.2
NetR18_2: R18.2 U2.20(PA3/SSI0FSS) U2.29(PF1/C1O/M1PWM5/PHB0/SSI1TX/T0CCP1/TRD1/U1CTS) ; port DEBUG_PC1/TMS/SWDIO
NetR20_2: R20.2 U2.41(OSC1)
NetR23_2: R23.2 U2.19(PA2/SSI0CLK) U2.30(PF2/M0FAULT0/M1PWM6/SSI1CLK/T1CCP0/TRD0) ; port DEBUG_PC0/TCK/SWCLK
NetR24_2: R24.2 U2.46(PB1/T2CCP1/U1TX/USB0VBUS)
NetU1_17: U2.18(PA1/CAN1TX/U0TX) ; port PA0/U0RX_VCP_TXD
NetU1_18: U2.17(PA0/CAN1RX/U0RX) ; port PA1/U0TX_VCP_RXD
NetU1_49: U2.21(PA4/SSI0RX) U2.53(PD6/M0FAULT0/PHA0/U2RX/WT5CCP0) ; port DEBUG_PC3/TDO/SWO
NetU1_50: U2.22(PA5/SSI0TX) ; port DEBUG_PC2/TDI

Not connected (* = marked no-connect by the designer): J5 1 7; J11 4(ID); U2 1(PB6/M0PWM0/SSI2RX/T0CCP0) 4(PB7/M0PWM1/SSI2TX/T0CCP1) 5(PF4/IDX0/M1FAULT0/T2CCP0/USB0EPEN) 6(PE3/AIN0) 7(PE2/AIN1) 8(PE1/AIN2/U7TX) 9(PE0/AIN3/U7RX) 10(PD7/NMI/PHB0/U2TX/WT5CCP1) 13(PC7/C0-/U3TX/USB0PFLT/WT1CCP1) 14(PC6/C0+/PHB1/U3RX/USB0EPEN/WT1CCP0) 15(PC5/C1+/M0PWM7/PHA1/U1CTS/U1TX/U4TX/WT0CCP1) 16(PC4/C1-/IDX1/M0PWM6/U1RTS/U1RX/U4RX/WT0CCP0) 24(PA7/I2C1SDA/M1PWM3) 28(PF0/C0O/CAN0RX/M1PWM4/NMI/PHA0/SSI1RX/T0CCP0/U1RTS) 31(PF3/CAN0TX/M1PWM7/SSI1FSS/T1CCP1/TRCLK) 33(~{HIB}) 36(XOSC1) 47(PB2/I2C0SCL/T3CCP0) 48(PB3/I2C0SDA/T3CCP1) 57(PB5/AIN11/CAN0TX/M0PWM3/SSI2FSS/T1CCP1) 58(PB4/AIN10/CAN0RX/M0PWM2/SSI2CLK/T1CCP0) 59(PE4/AIN9/CAN0RX/I2C2SCL/M0PWM4/M1PWM2/U5RX) 60(PE5/AIN8/CAN0TX/I2C2SDA/M0PWM5/M1PWM3/U5TX) 61(PD0/AIN7/I2C3SCL/M0PWM6/M1PWM0/SSI1CLK/SSI3CLK/WT2CCP0) 62(PD1/AIN6/I2C3SDA/M0PWM7/M1PWM1/SSI1FSS/SSI3FSS/WT2CCP1) 63(PD2/AIN5/M0FAULT0/SSI1RX/SSI3RX/USB0EPEN/WT3CCP0)

### Library data of the parts
C1 C2 C17 C20 C23 C24 = CMP-1034-02068-3: as C4 on sheet TivaC_Schemetic_Sheet1; ComponentLink2URL: https://content.kemet.com/datasheets/KEM_C1002_X7R_SMD.pdf; Automotive: No; Device Class L2: Capacitors; Temperature: -55°C to +125°C; RoHS: TRUE; Voltage Rating: 16 V; ComponentLink2Description: Datasheet; Device Class L3: Ceramic Capacitors; Temperature Range Low: -55°C; Ipc Land Pattern Name: CAPC10050X50; Device Class L1: Passive Components; Temperature Range High: +125°C; Package: C0402-BB; Capacitance: 0.10 μF; Category: Cap; Mouser Description: CAP CER 0.1UF 16V X7R 0402; Height: 0.55mm; Digikey Description: CAP CER 0.1UF 16V 5% X7R 0402; Octopart: https://octopart.com/c0402c104j4ractu-kemet-12573893; Temperature Characteristic: X7R; Lead Free: Yes
C9 = CMP-2006-02259-2: as C22 on sheet TivaC_Schemetic_Sheet1; Series: C; Voltage Rating (DC): 16V; REACH SVHC: No SVHC; RoHS Compliant: Yes; Number of Pins: 2; Max Operating Temperature: 85°C; Voltage Rating: 16V; Min Operating Temperature: -55°C; Termination: SMD/SMT; Dielectric: X5R; Packaging: Tape and Reel; Contact Plating: Tin; Case Code (Metric): 1608; Height: 0.8mm; Capacitance: 2.2uF; Case/Package: 0603; Width: 0.8mm; Construction: Flat; Depth: 0.8mm; Thickness: 0.034inch; Radiation Hardening: No; Length: 1.6mm; Mount: Surface Mount; Case Code (Imperial): 0603; Voltage: 16V; Package Quantity: 1; Lead Free: Lead Free
C14 = CMP-2008-02081-2: CAP CER 1UF 10V X5R 0402; Dielectric Material: Ceramic; Dissipation Factor: 5%; Tolerance: 10%; Number of Pins: 2; Contact Plating: Tin; Min Operating Temperature: -55°C; Termination: SMD/SMT; Lead Free: Lead Free; Construction: Flat; Voltage Rating (DC): 10V; Mount: Surface Mount; Series: C; Thickness: 0.022inch; Width: 0.5mm; Radiation Hardening: No; Capacitance: 1uF; Dielectric: X5R; Height: 0.5mm; Voltage: 10V; Length: 1mm; Depth: 0.5mm; Max Operating Temperature: 85°C; Package Quantity: 1; Packaging: Tape and Reel; RoHS Compliant: Yes; Case Code (Imperial): 0402; Case Code (Metric): 1005; REACH SVHC: No SVHC; Voltage Rating: 10V; Case/Package: 0402
C15 C19 C21 = CMP-1034-01886-2: as C3 on sheet TivaC_Schemetic_Sheet1
C18 = CMP-1034-01886-2: Manufacturer: Kemet; Part Number: C0402C103K5RACTU
C25 C26 = CMP-2100-03589-1: as C31 on sheet TivaC_Schemetic_Sheet1; Termination: SMD/SMT; Package Reference: 0402; Lead Free: LeadFree; Composition: Ceramic; Tolerance: 5%; Case Code (Metric): 1005; Voltage Rating: 50V; Packaging: TapeandReel; Manufacturer URL: http://www.yageo.com/; REACH SVHC: NoSVHC; Max Operating Temperature: 125degC; Length: 1mm; Mount: SurfaceMount; Depth: 0.5mm; Min Operating Temperature: -55degC; Number of Pins: 2; Width: 0.02inch; Datasheet Version: Rev. 14, 07/2016; Package Quantity: 1; Datasheet URL: http://www.yageo.com/documents/recent/UPY-GP_NP0_16V-to-50V_14.pdf; Case Code (Imperial): 0402; RoHSCompliant: True; Radiation Hardening: No; Height: 0.5mm; Case/Package: 0402; Thickness: 0.022inch; Capacitance: 10pF; Package Description: 2-Pin Surface Mount Device, Body 1 x 0.5 mm; Voltage: 50V
D4 = CMP-22017-000022-1: LED ORANGE CLEAR SMD; Number of Elements: 1; Reverse Voltage: 5V; Forward Voltage: 2.1V; Dominant Wavelength: 602nm; Power Dissipation: 100mW; Wavelength: 610nm; Test Current: 10mA; Luminous Intensity: 2mcd; Lens Color: Colorless; Lens Style: Diffused; Forward Current: 30mA; Viewing Angle: 130°; Depth: 1.25mm; Lens Transparency: Clear; Height: 1.1mm; Illumination Color: Orange; Lead Free: Lead Free; Case Code (Imperial): 0805; Max Power Dissipation: 100mW; Color: Orange; Min Operating Temperature: -55°C; Width: 1.25mm; Package Quantity: 1; Max Operating Temperature: 85°C; Case/Package: 0805; Number of LEDs: 1; Number of Pins: 2; Packaging: Tape and Reel; Length: 2mm; Radiation Hardening: No; Mount: Surface Mount; Case Code (Metric): 2012
J5 = TC2050-IDC-NL: MSP-FET430 Flash Emulation Tool Plug-Of-Nailsâ„¢ Adapter Cable; MF: Tag-Connect LLC; Price: None; Availability: In Stock; MP: TC2050-IDC-NL; Package: None; SnapEDA_Link: https://www.snapeda.com/parts/TC2050-IDC-NL/Tag-Connect+LLC/view-part/?ref=snap; Check_prices: https://www.snapeda.com/parts/TC2050-IDC-NL/Tag-Connect+LLC/view-part/?ref=eda; Value: *; Purchase-URL: https://pricing.snapeda.com/search/part/TC2050-IDC-NL/?ref=eda
J11 = CMP-1502-03252-3: as J9 on sheet TivaC_Schemetic_Sheet1; Height: 2.86mm; REACH SVHC: Unknown; RoHS: Compliant; Features: Shielded; Termination: SMD/SMT; Number of Pins: 5; Contact Plating: Gold; Packaging: Tape and Reel; Contact Material: Gold; Mount: Horizontal, Surface Mount; Max Operating Temperature: 85°C; Lead Free: Lead Free; Min Operating Temperature: -40°C; Orientation: Horizontal; Operating Supply Voltage: 30V
R16 R20 = CMP-07231-000023-1: as R26 on sheet TivaC_Schemetic_Sheet1; Depth: 0.8mm; Height: 0.45mm; Case Code (Metric): 1608; Number of Pins: 2; Max Operating Temperature: 155°C; Mount: Surface Mount; REACH SVHC: No SVHC; Radiation Hardening: No; Width: 0.8mm; Max Power Dissipation: 100mW; Thickness: 457um; Package Quantity: 5000; Composition: Thick Film; Case/Package: 0603; Military Standard: Not; Packaging: Tape and Reel; Voltage Rating: 50V; Case Code (Imperial): 0603; Min Operating Temperature: -55°C; Contact Plating: Tin; Length: 1.6mm; Termination: SMD/SMT
R18 R21-R23 = CMP-2002-04694-1: as R28 on sheet TivaC_Schemetic_Sheet1
R19 = CMP-2002-04694-1: Manufacturer: Bourns; Part Number: CR0402-FX-1002GLF
R24 = CMP-1011-00454-2: Part Number: CR0402-FX-3300GLF; Manufacturer: Bourns
R27 = CMP-1011-00454-2: 330; Manufacturer: Bourns; Part Number: CR0402-FX-3300GLF
SW3 = CMP-2000-05087-3: SWITCH SLIDE DPDT 300MA 6V; Switch Function: On-On; Actuator Type: Standard; Switch Travel: 2mm; Actuator Color: Black; Contact Resistance: 70mR; Electrical Life: 5000Cycles; Actuator Material: Nylon; REACH SVHC: No SVHC; Series: JS; Min Operating Temperature: -20°C; Depth: 7.5mm; Housing Material: Nylon; Voltage Rating (DC): 6V; Max Operating Temperature: 85°C; Contact Current Rating: 300mA; Package Quantity: 1; Contact Plating: Silver; Contact Material: Copper Alloy; Throw Configuration: DPDT; Current Rating: 300mA; Orientation: Vertical; Max Current Rating: 300mA; Max Voltage Rating (DC): 6V; Flammability Rating: UL94 V-2; Length: 9mm; Packaging: Tape and Reel; Mount: Surface Mount; Actuator Length: 2mm; Lead Free: Lead Free; Termination: Gull Wing; Radiation Hardening: No
U2 = CMP-0945-00006-2: Tiva C Series Microcontroller, 256 KB Flash, 32 KB SRAM, 12 Bit, 12 Channels, -40 to 85 degC, 64-Pin LQFP (PM), Green (RoHS & no Sb/Br); Manufacturer: Texas Instruments; Program Memory: 256 KB; UART: 4; ADC Channels: 12; Data Memory: 32 KB; Max Speed: 80 MHz; ADC Resolution: 12 Bit; GPIOs: 43; Tiva Series: Connected MCUs; Prefix: Qualified Device; I2C: 2; ComponentLink1URL: http://www.ti.com/; ComponentLink1Description: Manufacturer URL; PackageDescription: 64-Pin Plastic Quad Flatpack, Body 10 x 10 mm, Pitch 0.5 mm; Temperature Range: -40 to 85 degC; Mounting Technology: Surface Mount; ComponentLink3URL: http://www.ti.com/litv/pdf/mtqf008a; ComponentLink2Description: Datasheet; ComponentLink2URL: http://www.ti.com/lit/ds/symlink/tm4c123gh6pm.pdf; PartNumber: TM4C123GH6PMI; DatasheetVersion: Rev. 15741.2722; PackageReference: PM0064A; RoHS: TRUE; ComponentLink3Description: Package Specification; PackageVersion: 4040152/C
U8 = CMP-0395-00621-2: Single Output Low Noise LDO, 400 mA, Fixed 3.3 V Output, 1.7 to 5.5 V Input, with Reverse Current Protection, 8-pin SON (DRB), -40 to 85 degC, Green (RoHS & no Sb/Br); Manufacturer: Texas Instruments; Fixed Output Options(V): 3.3; Rating: Catalog; Accuracy(%): 1; Vdo(Typ)(mV): 75; SubFamily: Single Channel LDO; Vin(Min)(V): 1.7; Iq(Typ)(mA): 0.3; Vin(Max)(V): 5.5; Iout(Max)(A): 0.4; ComponentLink4URL: Samples URL:http://www.ti.com/product/tps73633#samples; PackageDescription: 8-Pin Plastic Small Outline, Body 3 x 3 mm, Pitch 0.65 mm; ComponentLink4Description: URL Link1; PackageReference: DRB0008A; Eco-Plan: Green (RoHS & no Sb/Br); ComponentLink1URL: http://www.ti.com/; PartNumber: TPS73633DRBR; Vout Adj(Max)(V): 3.3; ComponentLink3Description: Package Specification; ComponentLink3URL: http://www.ti.com/litv/pdf/mpds118h; PackageVersion: 4203482-2/K; ComponentLink2Description: Datasheet; DatasheetVersion: SBVS038T; Vout Adj(Min)(V): 3.3; Mounting Technology: Surface Mount; ComponentLink2URL: http://www.ti.com/general/docs/lit/getliterature.tsp?genericPartNumber=TPS73633&fileType=pdf; ComponentLink1Description: Manufacturer URL
Y5 = NX5032GA-16.000000MHZ-LN-CD-1: Package: None; Price: None; Availability: Unavailable; MP: NX5032GA-16.000000MHZ-LN-CD-1; Value: *

## Nets that join several sheets
+3.3V: TivaC_Schemetic_Sheet1 (J1&3.1), TivaC_Schemetic_Sheet2 (6 pins)
+MCU_PWR: TivaC_Schemetic_Sheet1 (R28.1 R31.2), TivaC_Schemetic_Sheet2 (R18.1 R23.1)
+USB_VBUS: TivaC_Schemetic_Sheet1 (J9.1 R29.2), TivaC_Schemetic_Sheet2 (SW3.1 SW3.4)
+VBUS: TivaC_Schemetic_Sheet1 (D1.2 J1&3.11), TivaC_Schemetic_Sheet2 (5 pins)
GND: TivaC_Schemetic_Sheet1 (26 pins), TivaC_Schemetic_Sheet2 (31 pins)
NetJ2&4_5: TivaC_Schemetic_Sheet1 (J2&4.5 R28.2 RESET.B U1.38), TivaC_Schemetic_Sheet2 (U2.23)
NetR18_2: TivaC_Schemetic_Sheet1 (U1.51), TivaC_Schemetic_Sheet2 (R18.2 U2.20 U2.29)
NetR23_2: TivaC_Schemetic_Sheet1 (U1.52), TivaC_Schemetic_Sheet2 (R23.2 U2.19 U2.30)
NetU1_17: TivaC_Schemetic_Sheet1 (U1.17), TivaC_Schemetic_Sheet2 (U2.18)
NetU1_18: TivaC_Schemetic_Sheet1 (U1.18), TivaC_Schemetic_Sheet2 (U2.17)
NetU1_49: TivaC_Schemetic_Sheet1 (U1.49), TivaC_Schemetic_Sheet2 (U2.21 U2.53)
NetU1_50: TivaC_Schemetic_Sheet1 (U1.50), TivaC_Schemetic_Sheet2 (U2.22)